# EAGLE design esp-oled (EAGLE 7.3.0)
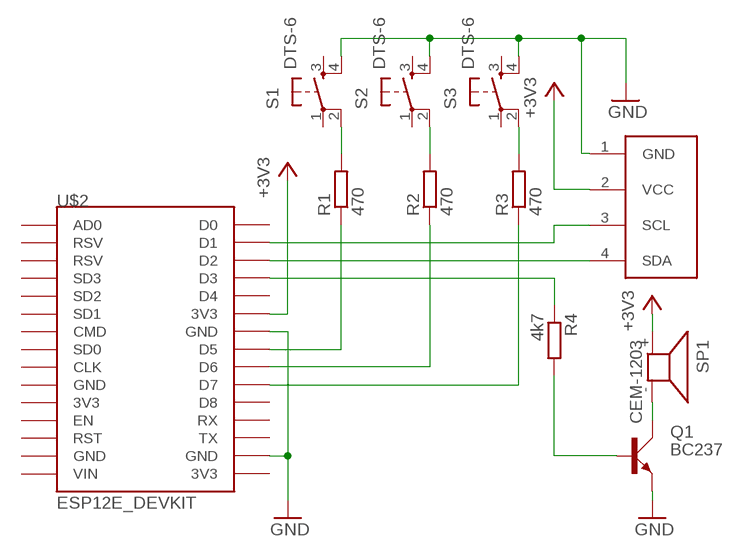
[diagram p0: schematic, sheet 1]

## Parts
Q1  BC237  [SOT54A]
R1  470  R-EU_0207/10B  [0207/10B]
R2  470  R-EU_0207/10B  [0207/10B]
R3  470  R-EU_0207/10B  [0207/10B]
R4  4k7  R-EU_0207/10B  [0207/10B]
S1  DTS-6  [DTS-6]
S2  DTS-6  [DTS-6]
S3  DTS-6  [DTS-6]
SP1  CEM-1203  KSS1201  [KSS1201]
U$1  I2C_OLED  [I2C_OLED_PACKAGE]
U$2  ESP12E_DEVKIT  [ESP12E_DEVKIT]

## Nets
+3V3: SP1.+ U$1.2(VCC) U$2.3V3@1(3V3)
GND: Q1.E S1.4 S2.4 S3.4 U$1.1(GND) U$2.GND@2(GND) U$2.GND@3(GND)
N$1: R1.1 U$2.D5
N$2: R2.1 U$2.D6
N$3: R3.1 U$2.D7
N$4: R1.2 S1.2
N$5: R2.2 S2.2
N$6: R3.2 S3.2
N$8: U$1.4(SDA) U$2.D2
N$9: U$1.3(SCL) U$2.D1
N$12: R4.1 U$2.D3
N$13: Q1.C SP1.-
N$14: Q1.B R4.2
Unconnected: S1.1 S1.3 S2.1 S2.3 S3.1 S3.3 U$2.3V3@0(3V3) U$2.3V3@2(3V3) U$2.AD0 U$2.CLK U$2.CMD U$2.D0 U$2.D4 U$2.D8 U$2.EN U$2.GND@0(GND) U$2.GND@1(GND) U$2.RST U$2.RSV@0(RSV) U$2.RSV@1(RSV) U$2.RX U$2.SD0 U$2.SD1 U$2.SD2 U$2.SD3 U$2.TX U$2.VIN

## Library data of the parts
Q1 = transistor-small-signal:BC237: NPN TRANSISTOR
R1-R4 = rcl:R-EU_: RESISTOR, European symbol
S1-S3 = switch-tact:DTS-6
SP1 = buzzer:KSS1201: SPEAKER Source: Schukat; OC_FARNELL: unknown; OC_NEWARK: unknown
U$1 = OLED_I2C:I2C_OLED
U$2 = ESP12E_DEVKIT:ESP12E_DEVKIT: ESP12E DEVKIT BOARD

## Board
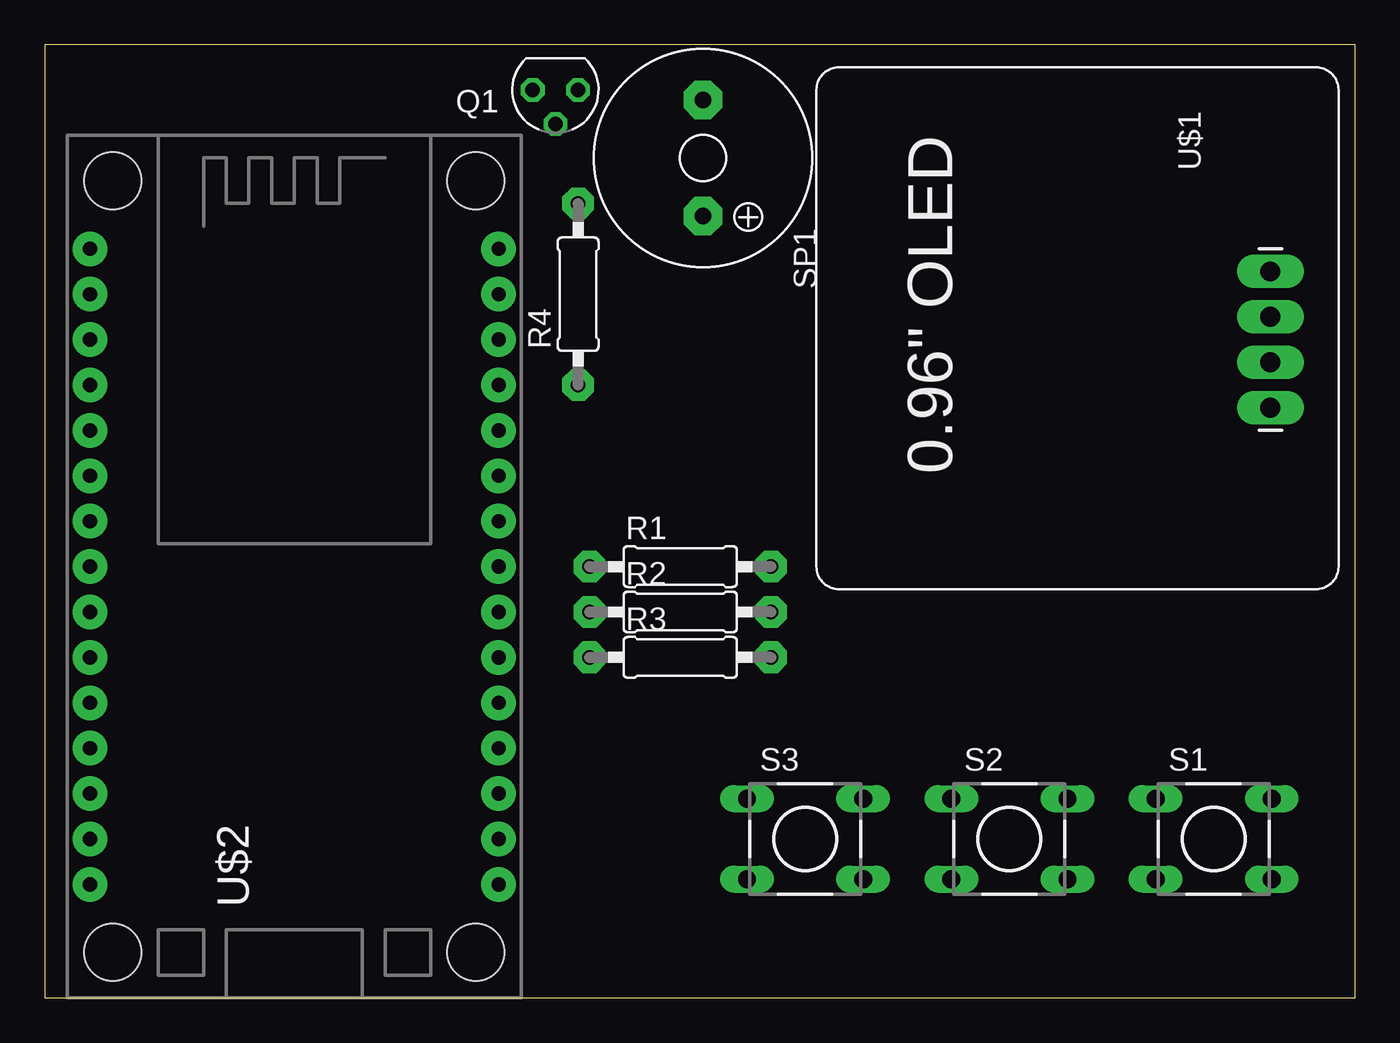
[diagram p1: board, top side]
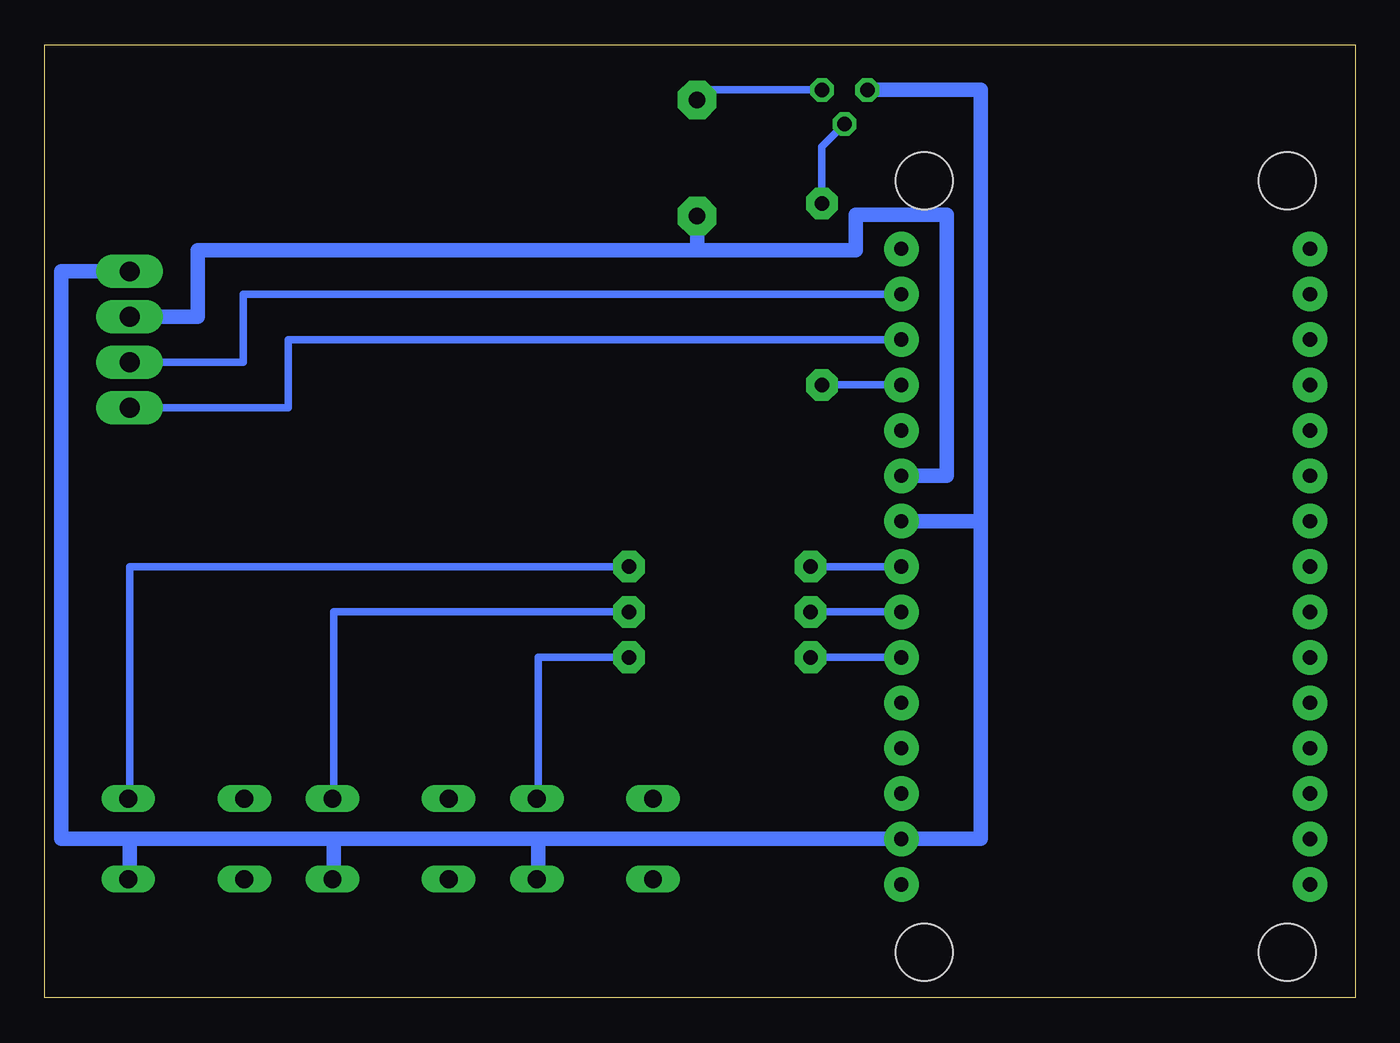
[diagram p2: board, bottom side, seen from below]

Size 73.33 x 53.33 mm. Coordinates in mm from the lower left corner, seen from the top.
Outline: 0,0 73.33,0 73.33,53.33 0,53.33 0,0
Copper layers (1*16): Top 0.035mm / dielectric 1.5mm / Bottom 0.035mm
Design rules "default": minimum track width 10mil, minimum drill 24mil, track to track 8mil, track to pad 8mil, pad to pad 8mil, via to via 8mil, smd to smd 8mil, copper to edge 40mil, drill to drill 8mil, minimum pad ring 10mil, minimum via ring 8mil, stop-mask expansion 4mil, vias tented up to drill 0mil, thermal gap 10mil

### Footprints (pad centres in the part's own frame; a part is rotated, then mirrored left to right if it is on the bottom)
SOT54A = drill 0.813 octagon: B 0,1.905; C -1.27,0; E 1.27,0
0207/10B = drill 0.813 pad 1.778 octagon: 1 -5.08,0; 2 5.08,0
DTS-6 = drill 1 long: 1 -3.25,2.25; 2 3.25,2.25; 3 -3.25,-2.25; 4 3.25,-2.25
KSS1201 = drill 0.914 pad 2.159 octagon: + 3.251,0; - -3.251,0
I2C_OLED_PACKAGE = drill 1.118 pad 1.88 long: 1 -3.81,11.43; 2 -1.27,11.43; 3 1.27,11.43; 4 3.81,11.43
ESP12E_DEVKIT = drill 0.8 pad 1.93: 3V3@0 -11.43,-7.62; 3V3@1 11.43,5.08; 3V3@2 11.43,-17.78; AD0 -11.43,17.78; CLK -11.43,-2.54; CMD -11.43,2.54; D0 11.43,17.78; D1 11.43,15.24; D2 11.43,12.7; D3 11.43,10.16; D4 11.43,7.62; D5 11.43,0; D6 11.43,-2.54; D7 11.43,-5.08; D8 11.43,-7.62; EN -11.43,-10.16; GND@0 -11.43,-5.08; GND@1 -11.43,-15.24; GND@2 11.43,2.54; GND@3 11.43,-15.24; RST -11.43,-12.7; RSV@0 -11.43,15.24; RSV@1 -11.43,12.7; RX 11.43,-10.16; SD0 -11.43,0; SD1 -11.43,5.08; SD2 -11.43,7.62; SD3 -11.43,10.16; TX 11.43,-12.7; VIN -11.43,-17.78 | hole 3.2: -10.16,21.59; 10.16,21.59; 10.16,-21.59; -10.16,-21.59

### Placement (x,y rotation side)
Q1  28.57,50.8 180 top
R1  35.56,24.13 0 top
R2  35.56,21.59 0 top
R3  35.56,19.05 0 top
R4  29.84,39.37 90 top
S1  65.41,8.89 0 top
S2  53.98,8.89 0 top
S3  42.55,8.89 0 top
SP1  36.83,46.99 270 top
U$1  57.15,36.83 270 top
U$2  13.97,24.13 0 top

### Tracks (layer width: path | path; a pad name or v marks a point on that pad's centre or on a via)
+3V3
  Bottom 0.813: U$2.3V3@1 22.86,29.21 22.86,43.81 27.94,43.81 27.94,41.83 36.83,41.83 | U$1.2 64.77,38.1 64.77,41.83 36.83,41.83 | SP1.+ 36.83,41.83
GND
  Bottom 0.406: S3.4 45.72,6.64 | S2.4 57.15,6.64 | S1.4 68.58,6.64
  Bottom 0.813: 45.72,8.89 U$2.GND@3 20.95,8.89 20.95,26.67 | 45.72,8.89 57.15,8.89 | 57.15,8.89 68.58,8.89 | 68.58,8.89 72.39,8.89 72.39,40.64 U$1.1 | Q1.E 20.95,50.8 20.95,26.67 | U$2.GND@2 20.95,26.67 | 45.72,6.64 45.72,8.89 | 57.15,6.64 57.15,8.89 | 68.58,6.64 68.58,8.89
N$1
  Bottom 0.406: U$2.D5 R1.1
N$2
  Bottom 0.406: U$2.D6 R2.1
N$3
  Bottom 0.406: U$2.D7 R3.1
N$4
  Bottom 0.406: S1.2 68.58,11.78 68.58,24.13 R1.2
N$5
  Bottom 0.406: S2.2 57.15,11.78 57.15,21.59 R2.2
N$6
  Bottom 0.406: S3.2 45.72,11.78 45.72,19.05 R3.2
N$8
  Bottom 0.406: U$2.D2 59.69,36.83 59.69,33.02 U$1.4
N$9
  Bottom 0.406: U$2.D1 62.23,39.37 62.23,35.56 U$1.3
N$12
  Bottom 0.406: U$2.D3 R4.1
N$13
  Bottom 0.406: SP1.- 36.27,50.8 Q1.C
N$14
  Bottom 0.406: Q1.B 29.84,47.62 R4.2